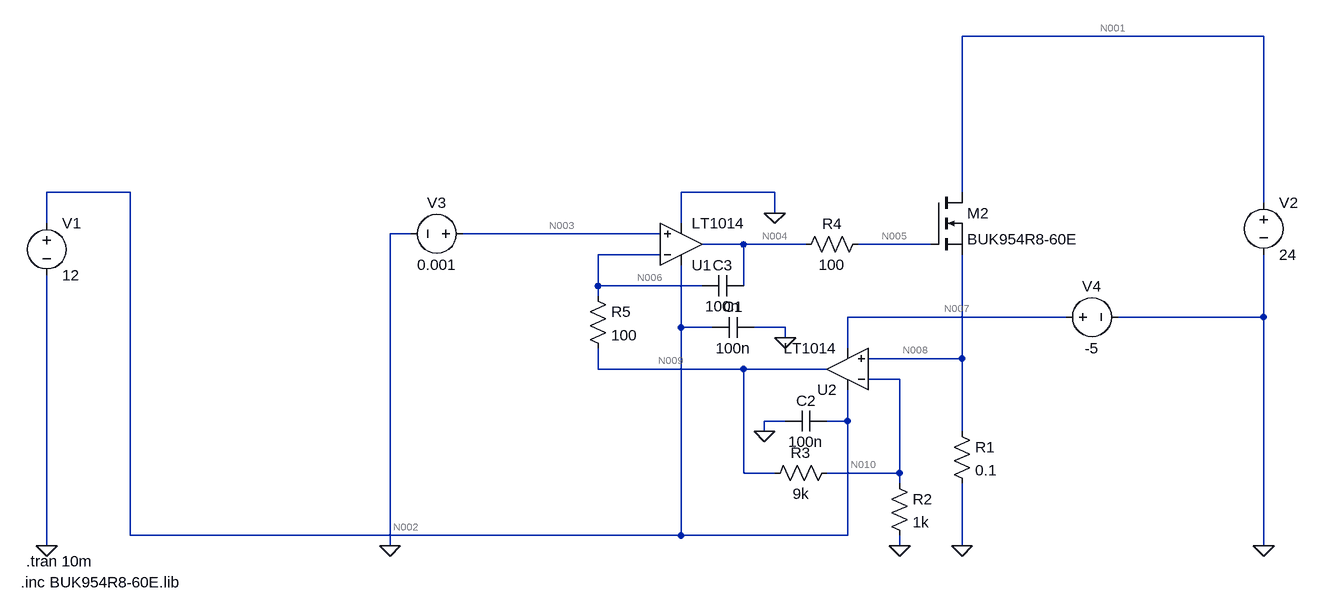
[diagram p0: schematic Spice Model - Version 1.asc]
Spice Model - Version 1.asc, the LTspice schematic file:
Version 4
SHEET 1 880 936
WIRE 672 -112 208 -112
WIRE -1072 128 -1200 128
WIRE -80 128 -224 128
WIRE 208 128 208 -112
WIRE 672 144 672 -112
WIRE -80 160 -80 128
WIRE -1200 176 -1200 128
WIRE -224 176 -224 128
WIRE -640 192 -672 192
WIRE -256 192 -560 192
WIRE -128 208 -192 208
WIRE -32 208 -128 208
WIRE 160 208 48 208
WIRE -256 224 -352 224
WIRE -352 272 -352 224
WIRE -192 272 -352 272
WIRE -128 272 -128 208
WIRE -352 288 -352 272
WIRE 368 320 32 320
WIRE 672 320 672 224
WIRE 672 320 448 320
WIRE -224 336 -224 240
WIRE -176 336 -224 336
WIRE -64 336 -112 336
WIRE -64 352 -64 336
WIRE 32 368 32 320
WIRE 208 384 208 224
WIRE 208 384 64 384
WIRE -352 400 -352 368
WIRE -128 400 -352 400
WIRE 0 400 -128 400
WIRE 112 416 64 416
WIRE -64 480 -96 480
WIRE 32 480 32 432
WIRE 32 480 0 480
WIRE -96 496 -96 480
WIRE 208 496 208 384
WIRE -128 560 -128 400
WIRE -80 560 -128 560
WIRE 112 560 112 416
WIRE 112 560 0 560
WIRE 112 576 112 560
WIRE -1072 656 -1072 128
WIRE -224 656 -224 336
WIRE -224 656 -1072 656
WIRE 32 656 32 480
WIRE 32 656 -224 656
WIRE -1200 672 -1200 256
WIRE -672 672 -672 192
WIRE 112 672 112 656
WIRE 208 672 208 576
WIRE 672 672 672 320
FLAG 112 672 0
FLAG -64 352 0
FLAG -96 496 0
FLAG -1200 672 0
FLAG -672 672 0
FLAG -80 160 0
FLAG 208 672 0
FLAG 672 672 0
SYMBOL Opamps\\LT1014 32 464 R180
SYMATTR InstName U2
SYMBOL voltage -1200 160 R0
WINDOW 123 0 0 Left 2
WINDOW 39 0 0 Left 2
SYMATTR InstName V1
SYMATTR Value 12
SYMBOL voltage 672 128 R0
WINDOW 123 0 0 Left 2
WINDOW 39 0 0 Left 2
SYMATTR InstName V2
SYMATTR Value 24
SYMBOL Opamps\\LT1014 -224 272 M180
SYMATTR InstName U1
SYMBOL res 96 560 R0
SYMATTR InstName R2
SYMATTR Value 1k
SYMBOL res 16 544 R90
WINDOW 0 0 56 VBottom 2
WINDOW 3 32 56 VTop 2
SYMATTR InstName R3
SYMATTR Value 9k
SYMBOL voltage -544 192 R90
WINDOW 0 -32 56 VBottom 2
WINDOW 3 32 56 VTop 2
WINDOW 123 0 0 Left 2
WINDOW 39 0 0 Left 2
SYMATTR InstName V3
SYMATTR Value 0.001
SYMBOL nmos 160 128 R0
SYMATTR InstName M2
SYMATTR Value BUK954R8-60E
SYMATTR Prefix X
SYMBOL cap -112 320 R90
WINDOW 0 0 32 VBottom 2
WINDOW 3 32 32 VTop 2
SYMATTR InstName C1
SYMATTR Value 100n
SYMBOL cap 0 464 R90
WINDOW 0 0 32 VBottom 2
WINDOW 3 32 32 VTop 2
SYMATTR InstName C2
SYMATTR Value 100n
SYMBOL res 192 480 R0
SYMATTR InstName R1
SYMATTR Value 0.1
SYMBOL res -48 224 R270
WINDOW 0 32 56 VTop 2
WINDOW 3 0 56 VBottom 2
SYMATTR InstName R4
SYMATTR Value 100
SYMBOL res -368 272 R0
SYMATTR InstName R5
SYMATTR Value 100
SYMBOL cap -128 256 R90
WINDOW 0 0 32 VBottom 2
WINDOW 3 32 32 VTop 2
SYMATTR InstName C3
SYMATTR Value 100n
SYMBOL voltage 352 320 R270
WINDOW 0 32 56 VTop 2
WINDOW 3 -32 56 VBottom 2
SYMATTR InstName V4
SYMATTR Value -5
TEXT -1232 696 Left 2 !.tran 10m
TEXT -1240 728 Left 2 !.inc BUK954R8-60E.lib

The netlist it stands for:
* Spice Model - Version 1.asc
XU2 N008 N010 N002 N007 N009 LT1014  ; pins In+ In- V+ V- OUT
V1 N002 0 12
V2 N001 0 24
XU1 N003 N006 N002 0 N004 LT1014  ; pins In+ In- V+ V- OUT
R2 N010 0 1k
R3 N010 N009 9k
V3 N003 0 0.001
XM2 N001 N005 N008 BUK954R8-60E  ; pins D G S
C1 0 N002 100n
C2 N002 0 100n
R1 N008 0 0.1
R4 N004 N005 100
R5 N006 N009 100
C3 N004 N006 100n
V4 N007 0 -5
.tran 10m
.inc BUK954R8-60E.lib
.backanno
.end

* Results of the author's LTspice run, read from the files saved beside the schematic
* Operating Point, zero values left out:
*   V(n010) = 111 µV
*   V(n008) = 110.6 µV
*   V(n002) = 12 V
*   V(n007) = -5 V
*   V(n009) = 999.3 µV
*   V(n001) = 24 V
*   V(n006) = 1.001 mV
*   V(n003) = 1 mV
*   V(n004) = 1.739 V
*   V(n005) = 1.739 V
*   I(R5) = 12.6 nA
*   I(R4) = 17.39 nA
*   I(R1) = 1.106 mA
*   I(R3) = -98.69 nA
*   I(R2) = 111 nA
*   I(V4) = 350 µA
*   I(V3) = 12.6 nA
*   I(V2) = -1.106 mA
*   I(V1) = -700.1 µA
*   Ix(u2:1) = -12.35 nA
*   Ix(u2:2) = -12.35 nA
*   Ix(u2:3) = 350.1 µA
*   Ix(u2:4) = -350 µA
*   Ix(u2:5) = -86.08 nA
*   Ix(u1:1) = -12.6 nA
*   Ix(u1:2) = -12.6 nA
*   Ix(u1:3) = 350 µA
*   Ix(u1:4) = -350 µA
*   Ix(u1:5) = -17.38 nA
*   Ix(m2:DRAIN) = 1.106 mA
*   Ix(m2:GATE) = 17.39 nA
*   Ix(m2:SOURCE) = -1.106 mA